# EAGLE design ESP8266_Single_RGB_RevA (EAGLE 9.6.2)
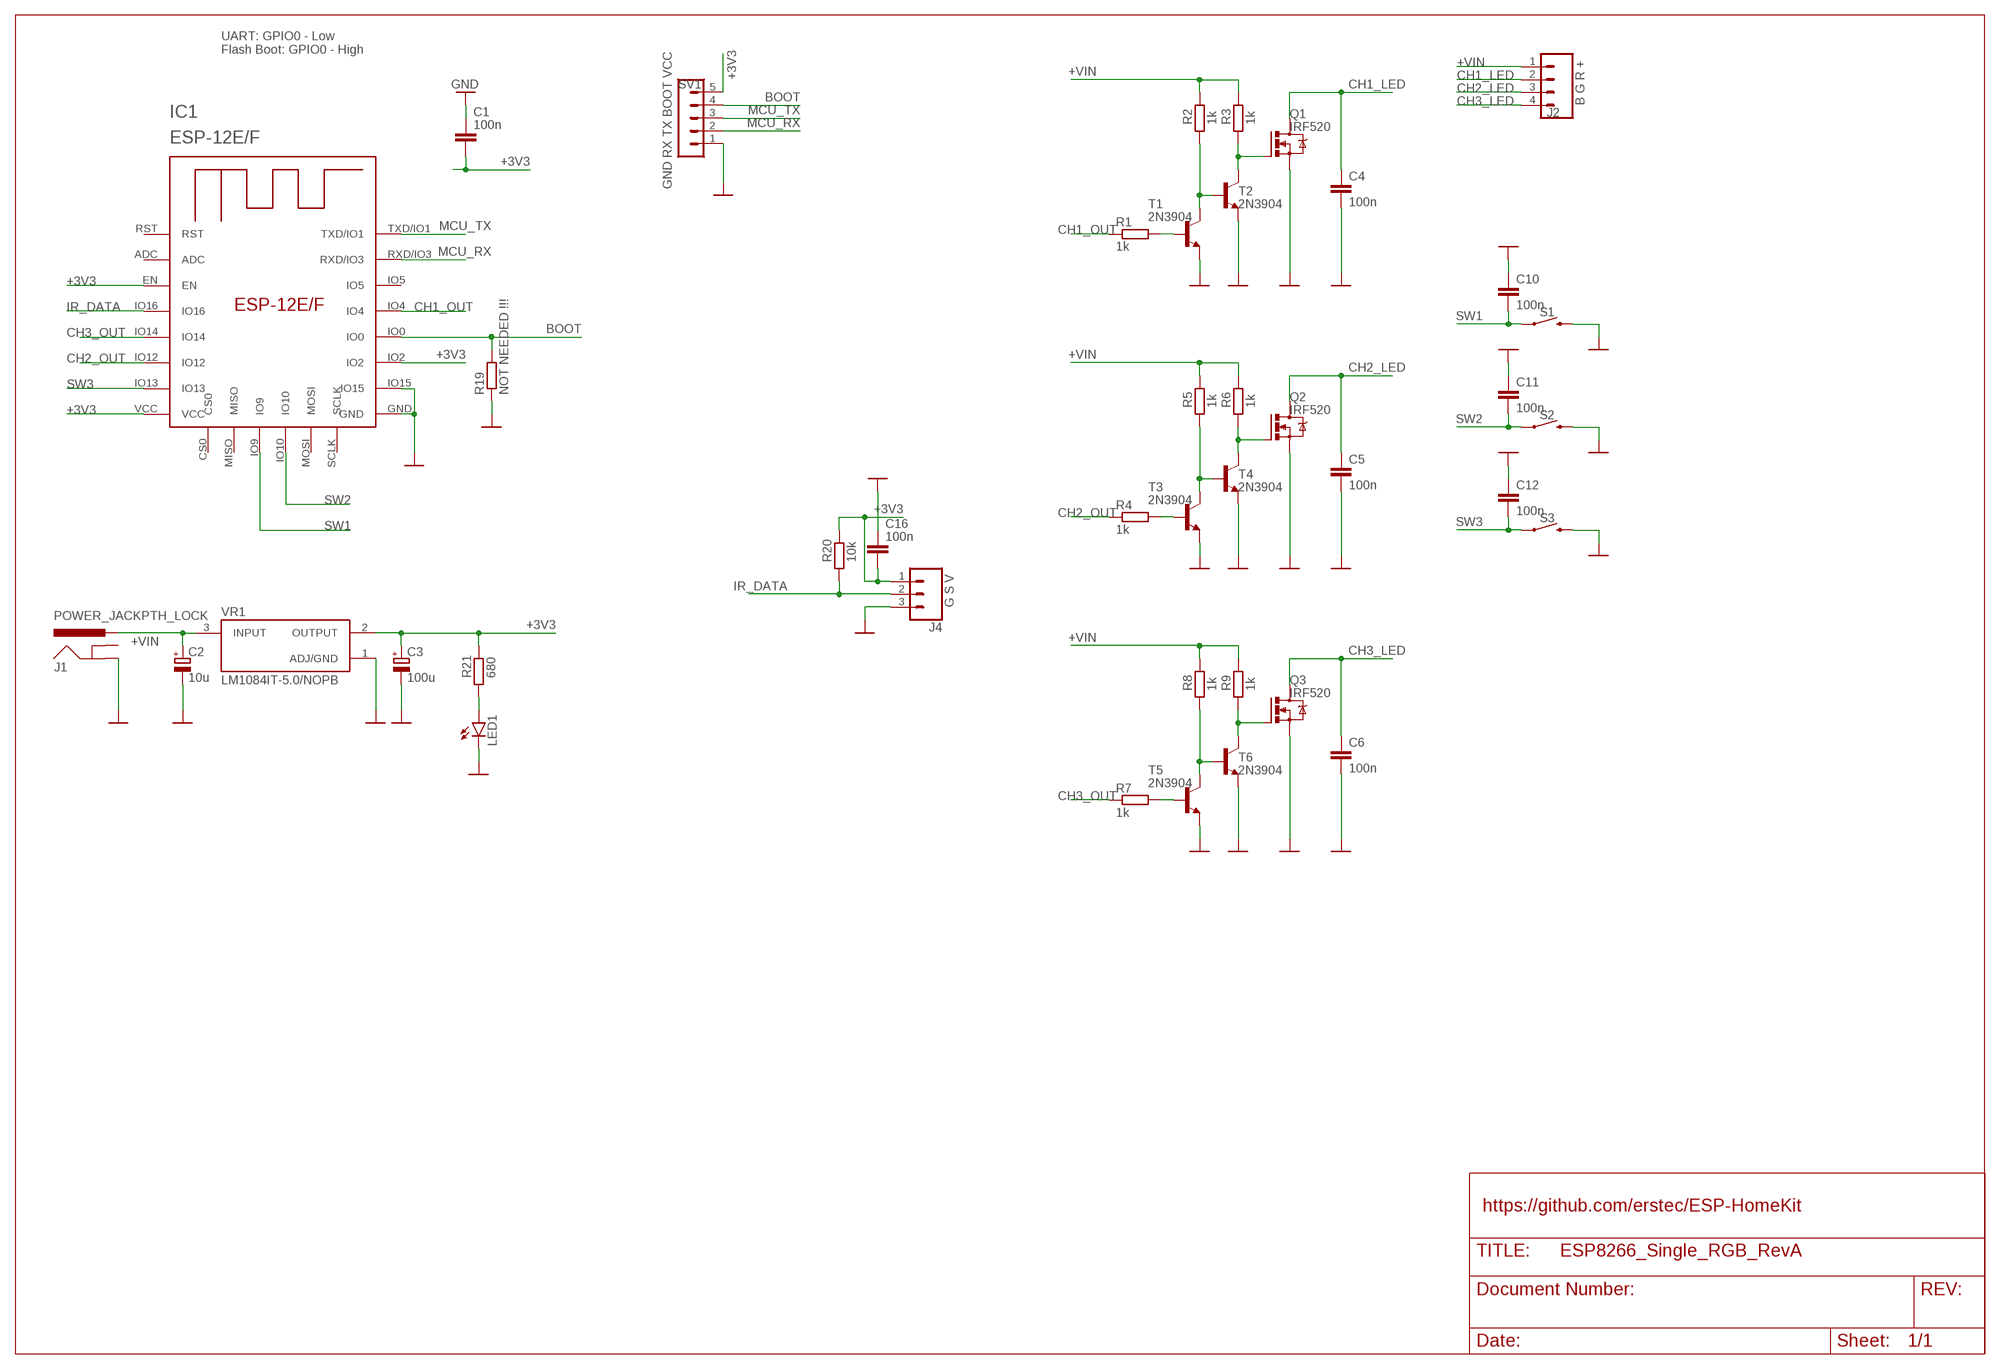
[diagram p0: schematic, sheet 1]

## Parts
C1  100n  C-EU025-024X044  [C025-024X044]
C2  10u  CPOL-EUE2,5-6E  [E2,5-6E]
C3  100u  CPOL-EUE2.5-6  [E2,5-6]
C4  100n  C-EU025-024X044  [C025-024X044]
C5  100n  C-EU025-024X044  [C025-024X044]
C6  100n  C-EU025-024X044  [C025-024X044]
C10  100n  C-EU025-024X044  [C025-024X044]
C11  100n  C-EU025-024X044  [C025-024X044]
C12  100n  C-EU025-024X044  [C025-024X044]
C16  100n  C-EU025-024X044  [C025-024X044]
IC1  ESP-12E/F  [ESP-12E]
J1  POWER_JACKPTH_LOCK  [POWER_JACK_PTH_LOCK]
J2  B G R +  CONN_04SCREW_LOCK  [SCREWTERMINAL-3.5MM-4_LOCK]
J4  G S V  CONN_03SCREW_LOCK  [SCREWTERMINAL-3.5MM-3_LOCK.007S]
LED1  LED5MM  [LED5MM]
Q1  IRF520  [TO220BV]
Q2  IRF520  [TO220BV]
Q3  IRF520  [TO220BV]
R1  1k  R-EU_0207/10  [0207/10]
R2  1k  R-EU_0207/10  [0207/10]
R3  1k  R-EU_0207/10  [0207/10]
R4  1k  R-EU_0207/10  [0207/10]
R5  1k  R-EU_0207/10  [0207/10]
R6  1k  R-EU_0207/10  [0207/10]
R7  1k  R-EU_0207/10  [0207/10]
R8  1k  R-EU_0207/10  [0207/10]
R9  1k  R-EU_0207/10  [0207/10]
R19  NOT NEEDED !!!  R-EU_0207/10  [0207/10]
R20  10k  R-EU_0207/10  [0207/10]
R21  680  R-EU_0207/10  [0207/10]
S1  MOMENTARY-SWITCH-SPST-PTH-6.0MM  [TACTILE_SWITCH_PTH_6.0MM]
S2  MOMENTARY-SWITCH-SPST-PTH-6.0MM  [TACTILE_SWITCH_PTH_6.0MM]
S3  MOMENTARY-SWITCH-SPST-PTH-6.0MM  [TACTILE_SWITCH_PTH_6.0MM]
SV1  GND RX TX BOOT VCC  MA05-1  [MA05-1]
T1  2N3904  [TO92]
T2  2N3904  [TO92]
T3  2N3904  [TO92]
T4  2N3904  [TO92]
T5  2N3904  [TO92]
T6  2N3904  [TO92]
VR1  LM1084IT-5.0/NOPB  [TO254P1054X470X1955-3]

## Nets
+3V3: C1.2 C3.+ C16.2 IC1.EN IC1.IO2 IC1.VCC J4.1 R20.2 R21.2 SV1.5 VR1.2(OUTPUT)
+VIN: C2.+ J1.PWR J2.1 R2.2 R3.2 R5.2 R6.2 R8.2 R9.2 VR1.3(INPUT)
BOOT: IC1.IO0 R19.2 SV1.4
CH1_LED: C4.1 J2.2 Q1.D
CH1_OUT: IC1.IO4 R1.1
CH2_LED: C5.1 J2.3 Q2.D
CH2_OUT: IC1.IO12 R4.1
CH3_LED: C6.1 J2.4 Q3.D
CH3_OUT: IC1.IO14 R7.1
GND: C1.1 C2.- C3.- C4.2 C5.2 C6.2 C10.1 C11.1 C12.1 C16.1 IC1.GND IC1.IO15 J1.GND J4.3 LED1.K(C) Q1.S Q2.S Q3.S R19.1 S1.3 S2.3 S3.3 SV1.1 T1.3(E) T2.3(E) T3.3(E) T4.3(E) T5.3(E) T6.3(E) VR1.1(ADJ/GND)
IR_DATA: IC1.IO16 J4.2 R20.1
MCU_RX: IC1.RXD/IO3 SV1.2
MCU_TX: IC1.TXD/IO1 SV1.3
N$1: R2.1 T1.1(C) T2.2(B)
N$2: R1.2 T1.2(B)
N$3: LED1.A R21.1
N$4: Q1.G R3.1 T2.1(C)
N$10: R5.1 T3.1(C) T4.2(B)
N$11: R4.2 T3.2(B)
N$13: Q2.G R6.1 T4.1(C)
N$16: R8.1 T5.1(C) T6.2(B)
N$17: R7.2 T5.2(B)
N$19: Q3.G R9.1 T6.1(C)
SW1: C10.2 IC1.IO9 S1.1
SW2: C11.2 IC1.IO10 S2.1
SW3: C12.2 IC1.IO13 S3.1
Unconnected: IC1.ADC IC1.CS0 IC1.IO5 IC1.MISO IC1.MOSI IC1.RST IC1.SCLK J1.GNDBREAK

## Notes on the sheet
- UART: GPIO0 - Low
  Flash Boot: GPIO0 - High
- https://github.com/erstec/ESP-HomeKit

## Library data of the parts
C1 C4-C6 C10-C12 C16 = rcl:C-EU: CAPACITOR, European symbol; SPICEPREFIX: C
C2 C3 = rcl:CPOL-EU: POLARIZED CAPACITOR, European symbol; SPICEPREFIX: C
IC1 = esp-12e-f:ESP-12E/F
J1 = SparkFun-Connectors:POWER_JACK: Power Jack Connector This is the standard 5.5mm barrel jack for power. The PTH is the most common, proven, reliable, footprint. The Slot footprint only works if the mill layer is transmitted to the PCB fab house so be warned. Here are the connectors we sell at SparkFun: DC Barrel Power Jack/Connector <https://www.sparkfun.com/products/119> (PRT-00119) DC Barrel Power Jack/Connector (SMD) <https://www.sparkfun.com/products/12748> (PRT-12748) DC Barrel Jack Adapter - Breadboard Compatible <https://www.sparkfun.com/products/10811> (PRT-10811) It is used on this SparkFun product (and many, many others): SparkFun RedBoard - Programmed with Arduino <https://www.sparkfun.com/products/12757> (DEV-12757) Also, if you need a mating power supply or connector, please check these out: Wall Adapter Power Supply - 9VDC 650mA <https://www.sparkfun.com/products/298> (TOL-00298) DC Barrel Jack Adapter - Male <https://www.sparkfun.com/products/10287> (PRT-10287); PROD_ID: CONN-08197; SF_ID: PRT-00119
J2 = SparkFun-Connectors:CONN_04: Multi connection point. Often used as Generic Header-pin footprint for 0.1 inch spaced/style header connections On any of the 0.1 inch spaced packages, you can populate with these: Break Away Headers - Straight <https://www.sparkfun.com/products/116> (PRT-00116) Break Away Male Headers - Right Angle <https://www.sparkfun.com/products/553> (PRT-00553) Female Headers <https://www.sparkfun.com/products/115> (PRT-00115) Break Away Headers - Machine Pin <https://www.sparkfun.com/products/117> (PRT-00117) Break Away Female Headers - Swiss Machine Pin <https://www.sparkfun.com/products/743> (PRT-00743) For SCREWTERMINALS and SPRING TERMINALS visit here: Screw Terimnals on SparkFun.com <https://www.sparkfun.com/search/results?term=Screw+Terminals> (5mm/3.5mm/2.54mm spacing) This device is also useful as a general connection point to wire up your design to another part of your project. Our various solder wires solder well into these plated through hole pads. Hook-Up Wire - Assortment (Stranded, 22 AWG) <https://www.sparkfun.com/products/11375> (PRT-11375) Hook-Up Wire - Assortment (Solid Core, 22 AWG) <https://www.sparkfun.com/products/11367> (PRT-11367) View the entire wire category on our website here <https://www.sparkfun.com/categories/141> Special notes: Molex polarized connector foot print use with SKU : PRT-08231 with associated crimp pins and housings. 1MM SMD Version SKU: PRT-10208
J4 = SparkFun-Connectors:CONN_03: Multi connection point. Often used as Generic Header-pin footprint for 0.1 inch spaced/style header connections On any of the 0.1 inch spaced packages, you can populate with these: Break Away Headers - Straight <https://www.sparkfun.com/products/116> (PRT-00116) Break Away Male Headers - Right Angle <https://www.sparkfun.com/products/553> (PRT-00553) Female Headers <https://www.sparkfun.com/products/115> (PRT-00115) Break Away Headers - Machine Pin <https://www.sparkfun.com/products/117> (PRT-00117) Break Away Female Headers - Swiss Machine Pin <https://www.sparkfun.com/products/743> (PRT-00743) Stackable Header - 3 Pin (Female, 0.1") <https://www.sparkfun.com/products/13875> (PRT-13875) For SCREWTERMINALS and SPRING TERMINALS visit here: Screw Terimnals on SparkFun.com <https://www.sparkfun.com/search/results?term=Screw+Terminals> (5mm/3.5mm/2.54mm spacing) This device is also useful as a general connection point to wire up your design to another part of your project. Our various solder wires solder well into these plated through hole pads. Hook-Up Wire - Assortment (Stranded, 22 AWG) <https://www.sparkfun.com/products/11375> (PRT-11375) Hook-Up Wire - Assortment (Solid Core, 22 AWG) <https://www.sparkfun.com/products/11367> (PRT-11367) View the entire wire category on our website here <https://www.sparkfun.com/categories/141> Special notes: Molex polarized connector foot print use with SKU : PRT-08232 with associated crimp pins and housings.; PROD_ID: CONN-08288; SF_ID: PRT-08235
LED1 = led:LED: LED OSRAM: - CHIPLED LG R971, LG N971, LY N971, LG Q971, LY Q971, LO R971, LY R971 LH N974, LH R974 LS Q976, LO Q976, LY Q976 LO Q996 - Hyper CHIPLED LW Q18S LB Q993, LB Q99A, LB R99A - SideLED LS A670, LO A670, LY A670, LG A670, LP A670 LB A673, LV A673, LT A673, LW A673 LH A674 LY A675 LS A676, LA A676, LO A676, LY A676, LW A676 LS A679, LY A679, LG A679 - Hyper Micro SIDELED® LS Y876, LA Y876, LO Y876, LY Y876 LT Y87S - SmartLED LW L88C, LW L88S LB L89C, LB L89S, LG L890 LS L89K, LO L89K, LY L89K LS L896, LA L896, LO L896, LY L896 - TOPLED LS T670, LO T670, LY T670, LG T670, LP T670 LSG T670, LSP T670, LSY T670, LOP T670, LYG T670 LG T671, LOG T671, LSG T671 LB T673, LV T673, LT T673, LW T673 LH T674 LS T676, LA T676, LO T676, LY T676, LB T676, LH T676, LSB T676, LW T676 LB T67C, LV T67C, LT T67C, LS T67K, LO T67K, LY T67K, LW E67C LS E67B, LA E67B, LO E67B, LY E67B, LB E67C, LV E67C, LT E67C LW T67C LS T679, LY T679, LG T679 LS T770, LO T770, LY T770, LG T770, LP T770 LB T773, LV T773, LT T773, LW T773 LH T774 LS E675, LA E675, LY E675, LS T675 LS T776, LA T776, LO T776, LY T776, LB T776 LHGB T686 LT T68C, LB T68C - Hyper Mini TOPLED® LB M676 - Mini TOPLED Santana® LG M470 LS M47K, LO M47K, LY M47K Source: http://www.osram.convergy.de LUXEON: - LUMILED® LXK2-PW12-R00, LXK2-PW12-S00, LXK2-PW14-U00, LXK2-PW14-V00 LXK2-PM12-R00, LXK2-PM12-S00, LXK2-PM14-U00 LXK2-PE12-Q00, LXK2-PE12-R00, LXK2-PE12-S00, LXK2-PE14-T00, LXK2-PE14-U00 LXK2-PB12-K00, LXK2-PB12-L00, LXK2-PB12-M00, LXK2-PB14-N00, LXK2-PB14-P00, LXK2-PB14-Q00 LXK2-PR12-L00, LXK2-PR12-M00, LXK2-PR14-Q00, LXK2-PR14-R00 LXK2-PD12-Q00, LXK2-PD12-R00, LXK2-PD12-S00 LXK2-PH12-R00, LXK2-PH12-S00 LXK2-PL12-P00, LXK2-PL12-Q00, LXK2-PL12-R00 Source: www.luxeon.com KINGBRIGHT: KA-3528ASYC Source: www.kingbright.com
Q1-Q3 = transistor-power:IRF520: HEXFET Power MOSFET
R1-R9 R19-R21 = rcl:R-EU_: RESISTOR, European symbol; SPICEPREFIX: R
S1-S3 = SparkFun-Switches:MOMENTARY-SWITCH-SPST: Momentary Switch (Pushbutton) - SPST Normally-open (NO) SPST momentary switches (buttons, pushbuttons). Variants PTH-12MM - 12mm square, through-hole Momentary Pushbutton Switch - 12mm Square <https://www.sparkfun.com/products/9190> (COM-09190) PTH-6.0MM, PTH-6.0MM-KIT - 6.0mm square, through-hole Mini Pushbutton Switch <https://www.sparkfun.com/products/97> (COM-00097) KIT package intended for soldering kit's - only one side of pads' copper is exposed. PTH-RIGHT-ANGLE-KIT - Right-angle, through-hole Right Angle Tactile Button <https://www.sparkfun.com/products/10791> - Used on SparkFun BigTime Watch Kit <https://www.sparkfun.com/products/11734> SMD-12MM - 12mm square, surface-mount Tactile Button - SMD (12mm) <https://www.sparkfun.com/products/12993> (COM-12993) Used on SparkFun PicoBoard <https://www.sparkfun.com/products/11888> SMD-4.5MM - 4.5mm Square Trackball Switch Used on SparkFun Blackberry Trackballer Breakout <https://www.sparkfun.com/products/13169> SMD-4.6MMX2.8MM - 4.60mm x 2.80mm, surface mount Used on SparkFun Pro Micro - RP2040 <https://www.sparkfun.com/products/17717> SMD-5.2MM, SMD-5.2-REDUNDANT - 5.2mm square, surface-mount Mini Pushbutton Switch - SMD <https://www.sparkfun.com/products/8720> (COM-08720) Used on Arduino Pro Mini <https://www.sparkfun.com/products/11114> REDUNDANT package connects both switch circuits together SMD-6.0X3.5MM - 6.0 x 3.5mm, surface mount Momentary Reset Switch SMD <https://www.sparkfun.com/products/8229> (COM-08229) SMD-6.2MM-TALL - 6.2mm square, surface mount Tactile Button - SMD (6mm) <https://www.sparkfun.com/products/12992> Used on SparkFun Digital Sandbox <https://www.sparkfun.com/products/12651> SMD-RIGHT-ANGLE - Right-angle, surface mount Used on SparkFun Block for Intel® Edison - Arduino <https://www.sparkfun.com/products/13036>; PROD_ID: SWCH-08441; SF_SKU: COM-00097
SV1 = con-lstb:MA05-1: PIN HEADER; OC_FARNELL: unknown; OC_NEWARK: unknown
T1-T6 = transistor:2N3904: NPN TRANSISTOR
VR1 = LM1084IT-5.0_NOPB:LM1084IT-5.0/NOPB: Check availability <https://pricing.snapeda.com/parts/LM1084IT-5.0/NOPB/Texas%20Instruments/view-part?ref=eda>; AVAILABILITY: In Stock; DESCRIPTION: 5.5-A, 29-V, linear voltage regulator; MF: Texas Instruments; MP: LM1084IT-5.0/NOPB; PACKAGE: TO-220-3 Texas Instruments; PRICE: None; PURCHASE-URL: https://pricing.snapeda.com/search/part/LM1084IT-5.0/NOPB/?ref=eda

## Board
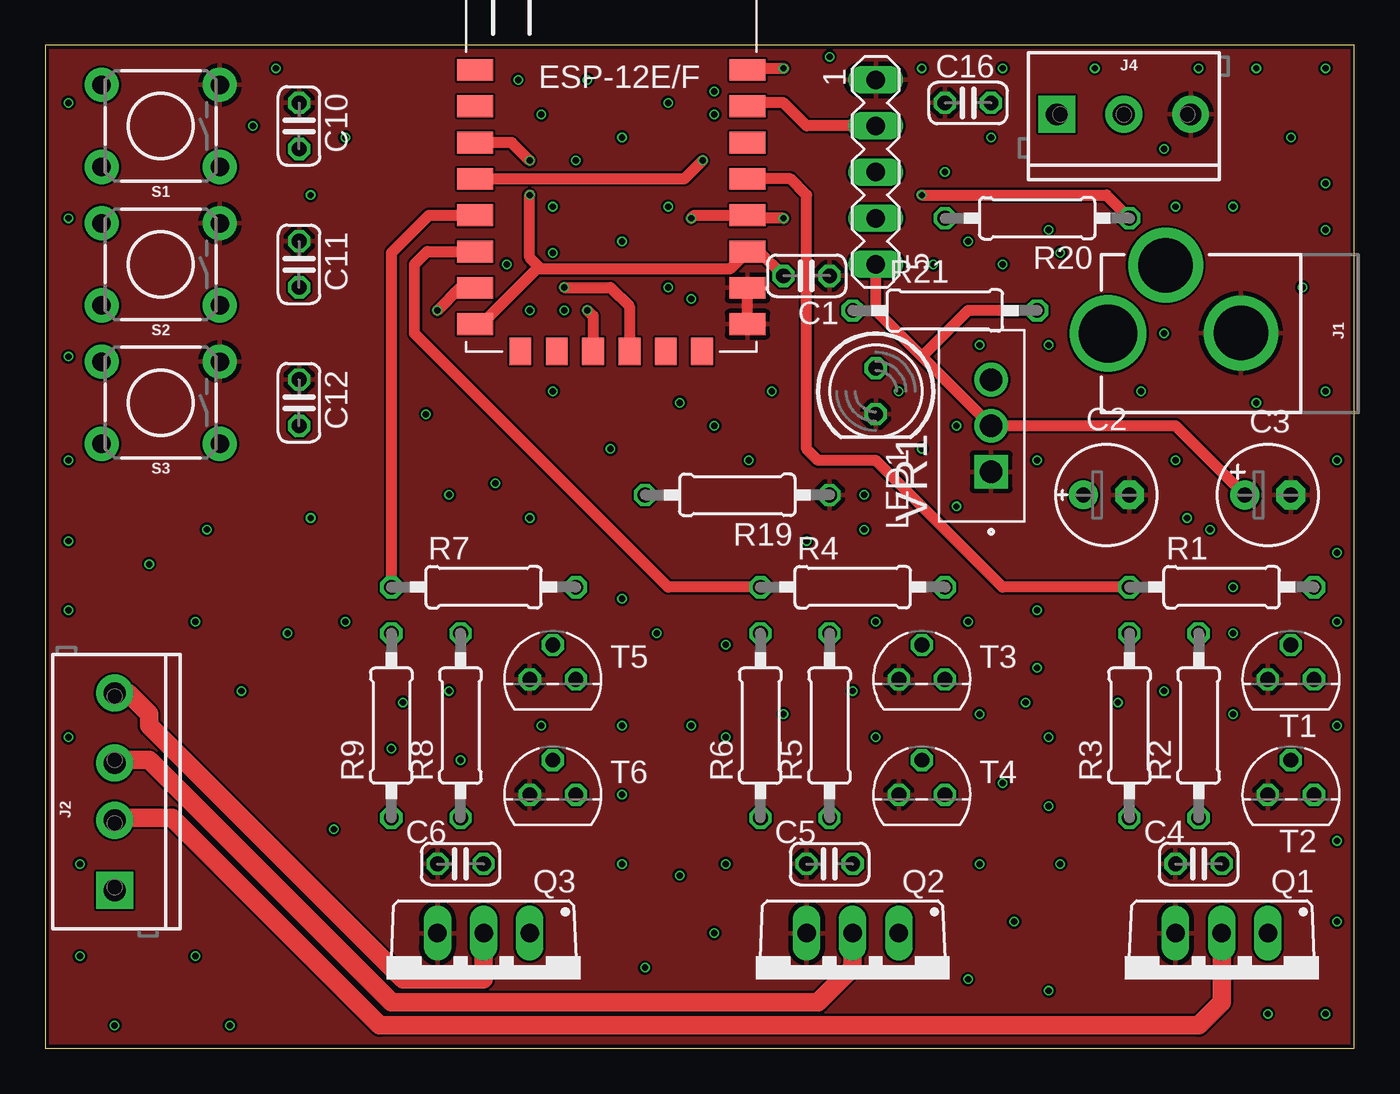
[diagram p1: board, top side]
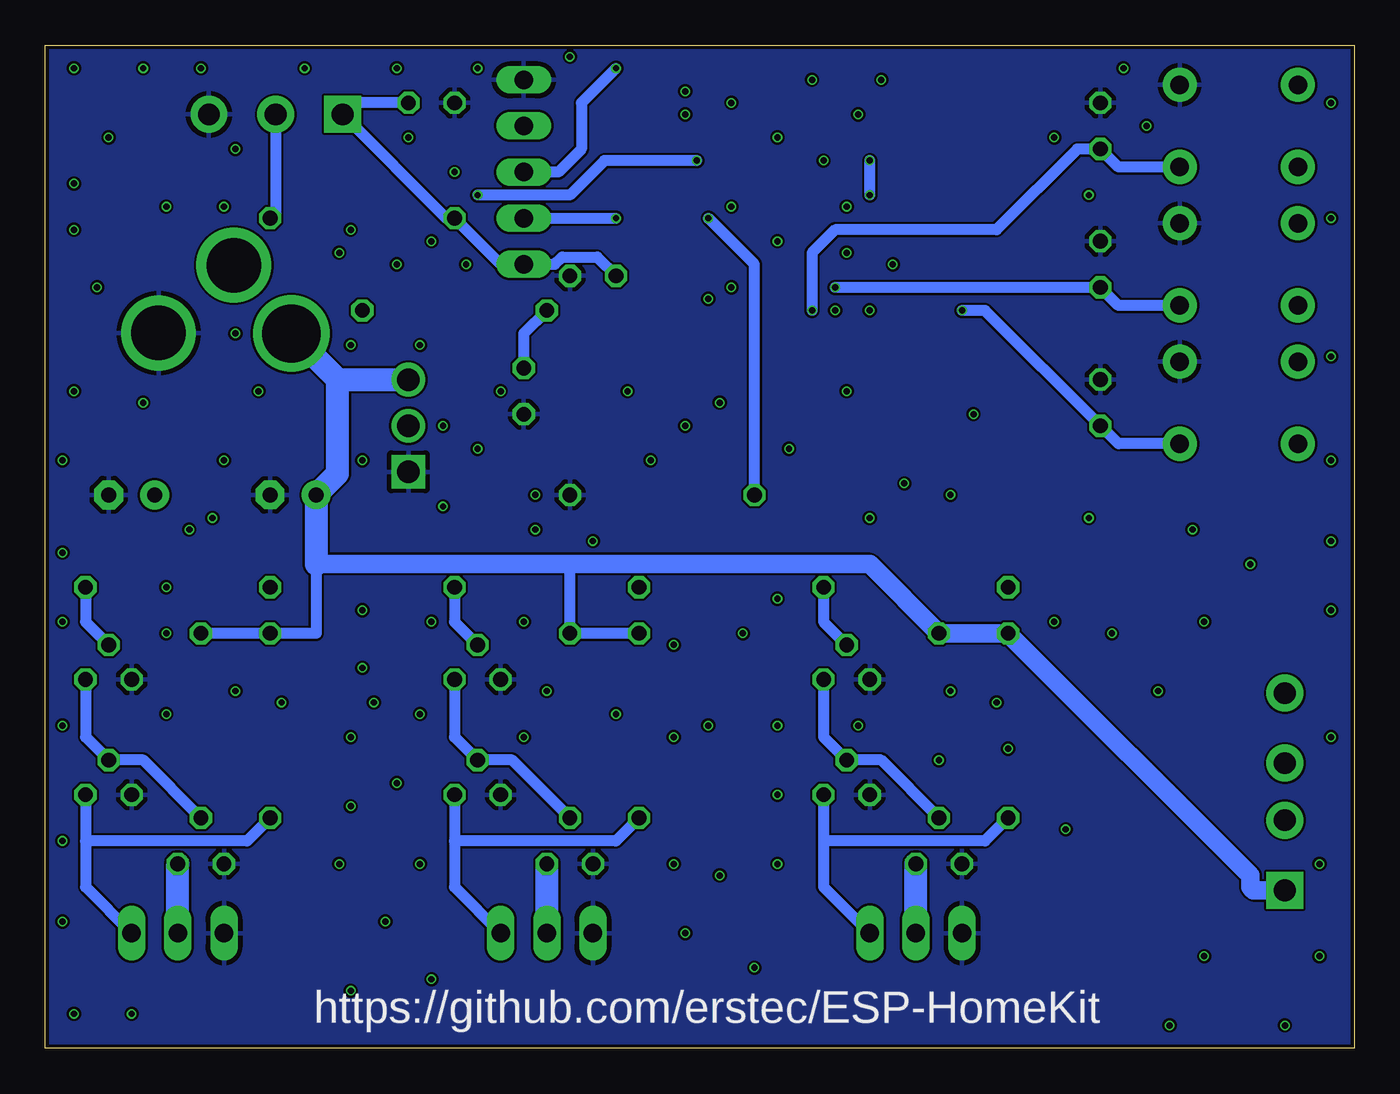
[diagram p2: board, bottom side, seen from below]

Size 72.06 x 55.23 mm. Coordinates in mm from the lower left corner, seen from the top.
Outline: 0,0 72.06,0 72.06,55.23 0,55.23 0,0
Copper layers (1*16): Top 0.035559375mm / dielectric 1.6mm / Bottom 0.035559375mm
Design rules "jlcpcb-2layers": minimum track width 5mil, minimum drill 12mil, track to track 5mil, track to pad 5mil, pad to pad 5mil, via to via 5mil, smd to smd 5mil, copper to edge 8mil, drill to drill 6mil, minimum pad ring 5mil, minimum via ring 3mil, stop-mask expansion 2.5mil, vias tented up to drill 0mil, thermal gap 10mil

### Footprints (pad centres in the part's own frame; a part is rotated, then mirrored left to right if it is on the bottom)
C025-024X044 = drill 0.813 octagon: 1 -1.27,0; 2 1.27,0
E2,5-6E = drill 0.813 pad 1.575: + -1.27,0 | drill 0.813 pad 1.575 octagon: - 1.27,0
E2,5-6 = drill 0.813 pad 1.6: + -1.27,0 | drill 0.813 pad 1.6 octagon: - 1.27,0
ESP-12E = smd 2 x 1.2: ADC -7.46,5.53; EN -7.46,3.53; GND 7.54,-6.47; IO0 7.54,-0.47; IO2 7.54,-2.47; IO4 7.54,1.53; IO5 7.54,3.53; IO12 -7.46,-2.47; IO13 -7.46,-4.47; IO14 -7.46,-0.47; IO15 7.54,-4.47; IO16 -7.46,1.53; RST -7.46,7.53; RXD/IO3 7.54,5.53; TXD/IO1 7.54,7.53; VCC -7.46,-6.47 | smd 1.2 x 1.5: CS0 -4.96,-7.97; IO9 -0.96,-7.97; IO10 1.04,-7.97; MISO -2.96,-7.97; MOSI 3.04,-7.97; SCLK 5.04,-7.97
POWER_JACK_PTH_LOCK = drill 2.997 pad 4.115: GND 0.025,6.557; GNDBREAK 3.762,10.7 | drill 3.2 pad 4.115: PWR 0,13.878
SCREWTERMINAL-3.5MM-4_LOCK = drill 1.2 pad 2.032 square: 1 -0.178,0 | drill 1.2 pad 2.032: 2 3.678,0; 3 6.822,0; 4 10.678,0
SCREWTERMINAL-3.5MM-3_LOCK.007S = drill 1.2 pad 2.032 square: 1 -0.178,0 | drill 1.2 pad 2.032: 2 3.5,0; 3 7.178,0
LED5MM = drill 0.813 octagon: A -1.27,0; K 1.27,0
TO220BV = drill 1.016 long: D 0,-2.54; G -2.54,-2.54; S 2.54,-2.54
0207/10 = drill 0.813 octagon: 1 -5.08,0; 2 5.08,0
TACTILE_SWITCH_PTH_6.0MM = drill 1.016 pad 1.88: 1 -3.251,2.261; 2 3.251,2.261; 3 -3.251,-2.261; 4 3.251,-2.261
MA05-1 = drill 1.016 long: 1 -5.08,0; 2 -2.54,0; 3 0,0; 4 2.54,0; 5 5.08,0
TO92 = drill 0.813 octagon: 1 1.27,0; 2 0,1.905; 3 -1.27,0
TO254P1054X470X1955-3 = drill 1.24 square: 1 -2.54,0 | drill 1.24: 2 0,0; 3 2.54,0

### Placement (x,y rotation side)
C1  41.91,42.55 180 top
C2  58.42,30.48 0 top
C3  67.31,30.48 0 top
C4  63.5,10.16 180 top
C5  43.18,10.16 180 top
C6  22.86,10.16 180 top
C10  13.97,50.8 270 top
C11  13.97,43.18 270 top
C12  13.97,35.56 270 top
C16  50.8,52.07 0 top
IC1  31.11,46.35 0 top
J1  72.39,39.37 90 top
J2  3.81,8.89 90 top
J4  55.88,51.44 0 top
LED1  45.72,36.2 270 top
Q1  64.77,3.81 180 top
Q2  44.45,3.81 180 top
Q3  24.13,3.81 180 top
R1  64.77,25.4 0 top
R2  63.5,17.78 90 top
R3  59.69,17.78 90 top
R4  44.45,25.4 0 top
R5  43.18,17.78 90 top
R6  39.37,17.78 90 top
R7  24.13,25.4 0 top
R8  22.86,17.78 90 top
R9  19.05,17.78 90 top
R19  38.1,30.48 180 top
R20  54.61,45.72 180 top
R21  49.53,40.64 0 top
S1  6.35,50.8 180 top
S2  6.35,43.18 180 top
S3  6.35,35.56 180 top
SV1  45.72,48.26 270 top
T1  68.58,20.32 0 top
T2  68.58,13.97 0 top
T3  48.26,20.32 0 top
T4  48.26,13.97 0 top
T5  27.94,20.32 0 top
T6  27.94,13.97 0 top
VR1  52.07,34.29 90 top

### Tracks (layer width: path | path; a pad name or v marks a point on that pad's centre or on a via)
+3V3  (via drill 0.35)
  Top 0.61: C3.+ 62.23,34.29 VR1.2 48.26,38.1 | 48.26,38.1 45.72,40.64 SV1.5 | R21.2 50.8,40.64 48.26,38.1 | C1.2 39.3,43.88 IC1.IO2 37.69,42.92 27.3,42.92 | IC1.VCC 24.01,39.88 27.04,42.92 27.3,42.92 | 27.3,42.92 26.67,43.55 v26.67,46.99 | v26.67,48.9 25.68,49.88 IC1.EN
  Bottom 0.61: C16.2 55.07,52.07 J4.1 49.99,45.72 R20.2 46.99,43.18 SV1.5 44.02,43.18 43.61,43.59 41.68,43.59 C1.2 | v26.67,46.99 v26.67,48.9
+VIN
  Bottom 0.61: R6.2 R5.2 43.18,26.67 | R2.2 R3.2 57.15,22.86 57.15,26.67
  Bottom 1.016: 57.15,26.67 43.18,26.67 26.67,26.67 R8.2 R9.2 5.71,9.53 5.71,8.89 5.54,8.71 J2.1
  Bottom 1.27: J1.PWR 55.97,36.83 | 55.97,36.83 VR1.3 | 55.97,36.83 55.97,31.66 C2.+ 57.15,26.67
BOOT  (via drill 0.35)
  Top 0.61: v35.56,45.72 35.73,45.88 IC1.IO0 38.82,45.72 v40.64,45.72
  Bottom 0.61: R19.2 33.02,43.18 v35.56,45.72 | SV1.4 v40.64,45.72
CH1_LED
  Top 1.016: Q1.D 64.77,2.54 63.5,1.27 18.41,1.27 6.99,12.7 3.94,12.7 J2.2
  Bottom 1.27: Q1.D C4.1
CH1_OUT
  Top 0.61: R1.1 52.7,25.4 45.72,32.38 42.55,32.38 41.91,33.02 41.91,46.99 41.02,47.88 IC1.IO4
CH2_LED
  Top 1.016: Q2.D 44.45,4.45 42.55,2.54 19.05,2.54 5.71,15.88 3.97,15.88 J2.3
  Bottom 1.27: Q2.D C5.1
CH2_OUT
  Top 0.61: R4.1 34.29,25.4 20.32,39.37 20.32,43.18 21.02,43.88 IC1.IO12
CH3_LED
  Top 1.016: Q3.D 24.13,3.81 19.68,3.81 5.71,17.78 5.71,18.41 4.56,19.57 J2.4
  Bottom 1.27: Q3.D C6.1
CH3_OUT
  Top 0.61: R7.1 19.05,43.81 21.12,45.88 IC1.IO14
GND
  Top 0.61: IC1.GND IC1.IO15
  pour Top: 0,55.24 72.39,55.24 72.39,0 0,0
  pour Bottom (rank 6): 0,55.24 72.39,55.24 72.39,0 0,0
IR_DATA  (via drill 0.35)
  Top 0.61: IC1.IO16 35.19,47.88 v36.2,48.9 | v48.26,46.99 58.42,46.99 R20.1
  Bottom 0.61: J4.2 59.38,46.03 R20.1 | v36.2,48.9 41.27,48.9 43.18,46.99 v48.26,46.99
MCU_RX
  Top 0.61: SV1.2 41.91,50.8 40.64,52.07 38.84,52.07 IC1.RXD/IO3
MCU_TX  (via drill 0.35)
  Top 0.61: IC1.TXD/IO1 38.74,53.98 v40.64,53.98
  Bottom 0.61: v40.64,53.98 42.55,52.07 42.55,49.53 43.81,48.26 SV1.3
N$1
  Bottom 0.61: T1.1 69.85,17.14 T2.2 66.67,15.88 R2.1
N$2
  Bottom 0.61: R1.2 69.85,23.5 T1.2
N$3
  Bottom 0.61: R21.1 45.72,39.37 LED1.A
N$4
  Bottom 0.61: T2.1 69.85,11.43 | 69.85,11.43 69.85,8.89 Q1.G | R3.1 60.96,11.43 69.85,11.43
N$5  (via drill 0.35)
  other vias: 1.27,32.38
N$6  (via drill 0.35)
  other vias: 1.27,52.07
N$7  (via drill 0.35)
  other vias: 1.27,45.72
N$8  (via drill 0.35)
  other vias: 1.27,27.94
N$9  (via drill 0.35)
  other vias: 1.27,24.13
N$10
  Bottom 0.61: T3.1 49.53,17.14 T4.2 46.35,15.88 R5.1
N$11
  Bottom 0.61: R4.2 49.53,23.5 T3.2
N$12  (via drill 0.35)
  other vias: 1.27,38.1
N$13
  Bottom 0.61: T4.1 49.53,11.43 | 49.53,11.43 49.53,8.89 Q2.G | R6.1 40.64,11.43 49.53,11.43
N$14  (via drill 0.35)
  other vias: 8.26,23.5
N$15  (via drill 0.35)
  other vias: 8.89,28.57
N$16
  Bottom 0.61: T5.1 29.21,17.14 T6.2 26.04,15.88 R8.1
N$17
  Bottom 0.61: R7.2 29.21,23.5 T5.2
N$18  (via drill 0.35)
  other vias: 5.71,26.67
N$19
  Bottom 0.61: T6.1 29.21,11.43 | 29.21,11.43 29.21,8.89 Q3.G | R9.1 20.32,11.43 29.21,11.43
N$20  (via drill 0.35)
  other vias: 14.61,29.21
N$21  (via drill 0.35)
  other vias: 13.34,22.86
N$22  (via drill 0.35)
  other vias: 10.79,19.68
N$23  (via drill 0.35)
  other vias: 1.27,17.14
N$24  (via drill 0.35)
  other vias: 1.91,10.16
N$25  (via drill 0.35)
  other vias: 1.91,5.08
N$26  (via drill 0.35)
  other vias: 3.81,1.27
N$27  (via drill 0.35)
  other vias: 10.16,1.27
N$28  (via drill 0.35)
  other vias: 8.26,5.08
N$29  (via drill 0.35)
  other vias: 15.88,12.06
N$30  (via drill 0.35)
  other vias: 16.51,23.5
N$31  (via drill 0.35)
  other vias: 31.75,10.16
N$32  (via drill 0.35)
  other vias: 33.02,4.45
N$33  (via drill 0.35)
  other vias: 36.83,6.35
N$34  (via drill 0.35)
  other vias: 34.92,9.53
N$35  (via drill 0.35)
  other vias: 35.56,17.78
N$36  (via drill 0.35)
  other vias: 37.47,10.16
N$37  (via drill 0.35)
  other vias: 67.31,1.91
N$38  (via drill 0.35)
  other vias: 70.48,1.91
N$39  (via drill 0.35)
  other vias: 22.23,30.48
N$40  (via drill 0.35)
  other vias: 20.95,34.92
N$41  (via drill 0.35)
  other vias: 24.77,31.11
N$42  (via drill 0.35)
  other vias: 27.94,36.2
N$43  (via drill 0.35)
  other vias: 31.11,33.02
N$44  (via drill 0.35)
  other vias: 36.83,34.29
N$45  (via drill 0.35)
  other vias: 40.01,36.2
N$46  (via drill 0.35)
  other vias: 34.29,46.35
N$47  (via drill 0.35)
  other vias: 31.75,44.45
N$48  (via drill 0.35)
  other vias: 27.94,46.35
N$49  (via drill 0.35)
  other vias: 27.3,51.44
N$50  (via drill 0.35)
  other vias: 29.84,53.34
N$51  (via drill 0.35)
  other vias: 34.29,52.07
N$52  (via drill 0.35)
  other vias: 31.75,50.16
N$53  (via drill 0.35)
  other vias: 35.56,41.27
N$54  (via drill 0.35)
  other vias: 34.29,41.91
N$55  (via drill 0.35)
  other vias: 27.94,43.81
N$56  (via drill 0.35)
  other vias: 25.4,43.18
N$57  (via drill 0.35)
  other vias: 26.67,40.64
N$58  (via drill 0.35)
  other vias: 28.57,40.64
N$59  (via drill 0.35)
  other vias: 36.83,52.7
N$60  (via drill 0.35)
  other vias: 36.83,51.44
N$61  (via drill 0.35)
  other vias: 43.18,54.61
N$62  (via drill 0.35)
  other vias: 49.53,48.26
N$63  (via drill 0.35)
  other vias: 38.73,32.38
N$64  (via drill 0.35)
  other vias: 34.92,35.56
N$65  (via drill 0.35)
  other vias: 26.67,29.21
N$66  (via drill 0.35)
  other vias: 45.09,28.57
N$67  (via drill 0.35)
  other vias: 45.09,30.48
N$68  (via drill 0.35)
  other vias: 29.21,48.9
N$69  (via drill 0.35)
  other vias: 26.04,53.34
N$84  (via drill 0.35)
  other vias: 55.24,3.17
N$85  (via drill 0.35)
  other vias: 55.88,10.16
N$86  (via drill 0.35)
  other vias: 52.7,14.61
N$87  (via drill 0.35)
  other vias: 51.44,10.16
N$88  (via drill 0.35)
  other vias: 50.8,3.81
N$89  (via drill 0.35)
  other vias: 53.34,6.99
N$94  (via drill 0.35)
  other vias: 37.47,17.14
N$95  (via drill 0.35)
  other vias: 40.64,18.41
N$96  (via drill 0.35)
  other vias: 44.45,19.68
N$97  (via drill 0.35)
  other vias: 45.72,17.14
N$98  (via drill 0.35)
  other vias: 37.47,22.23
N$100  (via drill 0.35)
  other vias: 33.66,22.86
N$101  (via drill 0.35)
  other vias: 31.75,24.77
N$102  (via drill 0.35)
  other vias: 31.75,17.78
N$103  (via drill 0.35)
  other vias: 27.3,17.78
N$104  (via drill 0.35)
  other vias: 31.75,13.97
N$112  (via drill 0.35)
  other vias: 22.86,15.88
N$113  (via drill 0.35)
  other vias: 22.23,19.68
N$114  (via drill 0.35)
  other vias: 19.68,19.05
N$115  (via drill 0.35)
  other vias: 19.05,16.51
N$141  (via drill 0.35)
  other vias: 41.91,27.94
N$144  (via drill 0.35)
  other vias: 45.72,23.5
N$145  (via drill 0.35)
  other vias: 50.8,23.5
N$146  (via drill 0.35)
  other vias: 51.44,18.41
N$147  (via drill 0.35)
  other vias: 55.24,13.34
N$148  (via drill 0.35)
  other vias: 55.24,17.14
N$149  (via drill 0.35)
  other vias: 54.61,20.95
N$150  (via drill 0.35)
  other vias: 54.61,24.13
N$151  (via drill 0.35)
  other vias: 53.98,19.05
N$152  (via drill 0.35)
  other vias: 65.41,22.86
N$153  (via drill 0.35)
  other vias: 65.41,18.41
N$154  (via drill 0.35)
  other vias: 71.12,17.78
N$155  (via drill 0.35)
  other vias: 71.12,11.43
N$156  (via drill 0.35)
  other vias: 71.12,6.99
N$158  (via drill 0.35)
  other vias: 71.12,23.5
N$159  (via drill 0.35)
  other vias: 71.12,27.3
N$160  (via drill 0.35)
  other vias: 65.41,25.4
N$161  (via drill 0.35)
  other vias: 64.14,28.57
N$162  (via drill 0.35)
  other vias: 61.59,19.68
N$163  (via drill 0.35)
  other vias: 59.05,19.05
N$164  (via drill 0.35)
  other vias: 62.87,29.21
N$165  (via drill 0.35)
  other vias: 62.23,32.38
N$167  (via drill 0.35)
  other vias: 54.61,32.38
N$169  (via drill 0.35)
  other vias: 50.16,29.84
N$170  (via drill 0.35)
  other vias: 50.16,34.29
N$171  (via drill 0.35)
  other vias: 48.26,33.02
N$172  (via drill 0.35)
  other vias: 46.99,36.2
N$177  (via drill 0.35)
  other vias: 48.9,43.18
N$178  (via drill 0.35)
  other vias: 52.7,43.18
N$179  (via drill 0.35)
  other vias: 55.88,43.81
N$180  (via drill 0.35)
  other vias: 50.8,44.45
N$181  (via drill 0.35)
  other vias: 52.07,50.16
N$185  (via drill 0.35)
  other vias: 48.26,53.98
N$186  (via drill 0.35)
  other vias: 52.7,53.98
N$187  (via drill 0.35)
  other vias: 57.78,53.98
N$188  (via drill 0.35)
  other vias: 63.5,53.98
N$189  (via drill 0.35)
  other vias: 61.59,49.53
N$191  (via drill 0.35)
  other vias: 55.24,45.09
N$192  (via drill 0.35)
  other vias: 66.67,53.98
N$193  (via drill 0.35)
  other vias: 70.48,53.98
N$194  (via drill 0.35)
  other vias: 70.48,47.62
N$195  (via drill 0.35)
  other vias: 68.58,50.16
N$196  (via drill 0.35)
  other vias: 65.41,46.35
N$197  (via drill 0.35)
  other vias: 70.48,45.09
N$198  (via drill 0.35)
  other vias: 62.23,46.35
N$199  (via drill 0.35)
  other vias: 69.22,41.91
N$200  (via drill 0.35)
  other vias: 70.48,36.2
N$201  (via drill 0.35)
  other vias: 61.59,39.37
N$202  (via drill 0.35)
  other vias: 60.33,36.2
N$203  (via drill 0.35)
  other vias: 66.67,35.56
N$204  (via drill 0.35)
  other vias: 71.12,32.38
N$205  (via drill 0.35)
  other vias: 55.24,38.73
N$206  (via drill 0.35)
  other vias: 51.44,38.73
N$227  (via drill 0.35)
  other vias: 12.7,53.98
N$228  (via drill 0.35)
  other vias: 11.43,50.8
N$229  (via drill 0.35)
  other vias: 14.61,46.99
N$231  (via drill 0.35)
  other vias: 16.51,50.16
SW1  (via drill 0.35)
  Top 0.61: v29.84,40.64 30.16,40.33 IC1.IO9
  Bottom 0.61: S1.1 12.98,48.54 C10.2 15.24,49.53 19.68,45.09 28.57,45.09 29.84,43.81 v29.84,40.64
SW2  (via drill 0.35)
  Top 0.61: v28.57,41.91 31.11,41.91 32.16,40.87 IC1.IO10
  Bottom 0.61: S2.1 12.98,40.92 C11.2 v28.57,41.91
SW3  (via drill 0.35)
  Top 0.61: v21.59,40.64 22.84,41.88 IC1.IO13
  Bottom 0.61: S3.1 12.98,33.3 C12.2 20.32,40.64 v21.59,40.64

### Text on the board
bNames: https://github.com/erstec/ESP-HomeKit